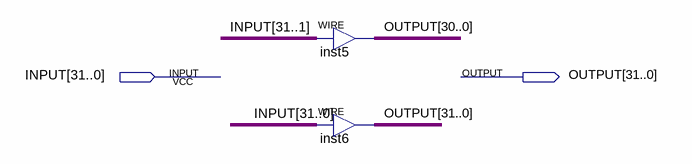
[diagram p0: schematic sheet]
// Quartus schematic SRA1.bdf as structural Verilog: 2 symbols, 2 pins
module SRA1 (
  input  [31:0] INPUT,
  output [31:0] OUTPUT
);

  assign OUTPUT[30:0] = INPUT[31:1];  // WIRE inst5
  assign OUTPUT = INPUT;  // WIRE inst6
endmodule
